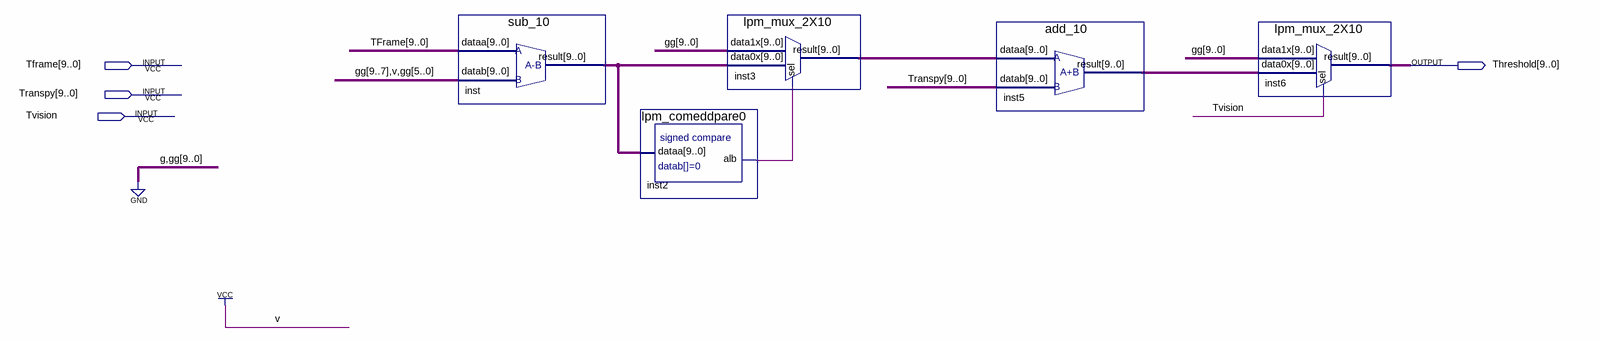
[diagram p0: schematic sheet]
// Quartus schematic Th_adaptive.bdf as structural Verilog: 5 symbols, 4 pins
module Th_adaptive (
  input  [9:0] Tframe,
  input  [9:0] Transpy,
  input  Tvision,
  output [9:0] Threshold
);

  wire inst2_alb;
  wire [9:0] inst3_result, inst5_result, inst_result;

  sub_10 inst (.dataa(Tframe), .datab(10'b0001000000), .result(inst_result));
  lpm_comeddpare0 inst2 (.dataa(inst_result), .alb(inst2_alb));
  lpm_mux_2X10 inst3 (.data1x({10{1'b0}}), .data0x(inst_result), .sel(inst2_alb), .result(inst3_result));
  add_10 inst5 (.dataa(inst3_result), .datab(Transpy), .result(inst5_result));
  lpm_mux_2X10 inst6 (.data1x({10{1'b0}}), .data0x(inst5_result), .sel(Tvision), .result(Threshold));
endmodule
